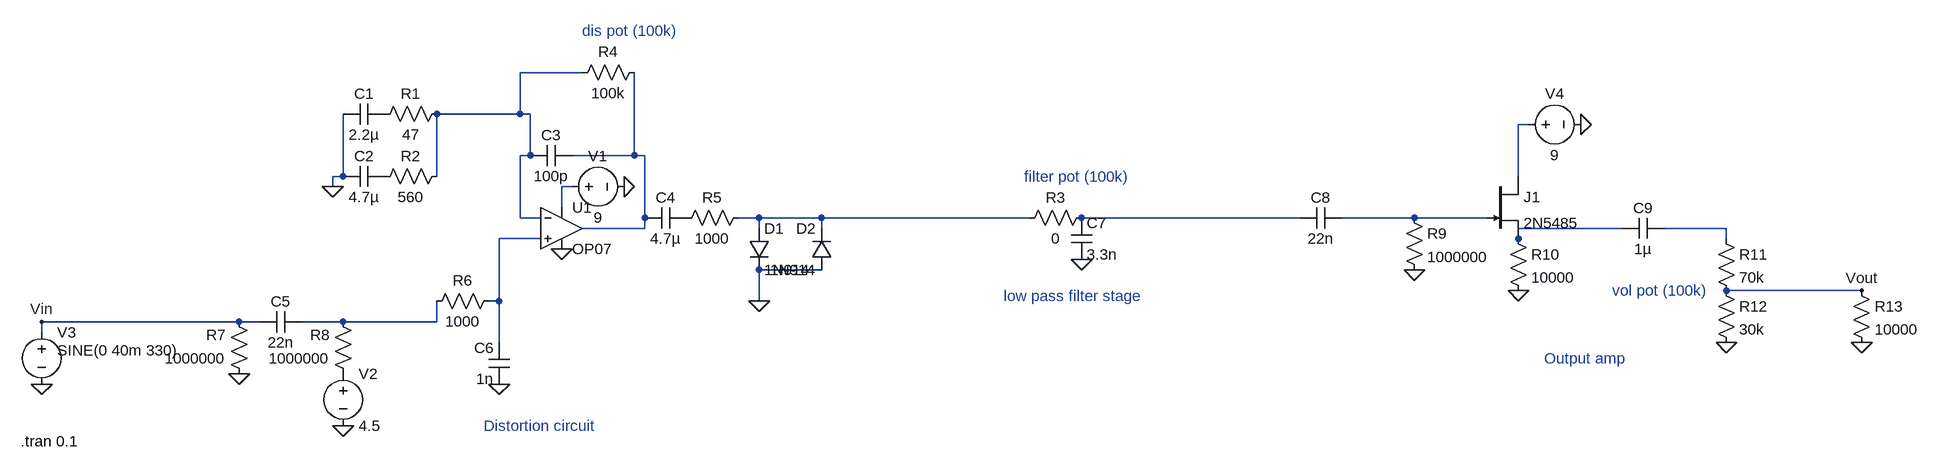
[diagram p0: schematic distortion sim.asc]
distortion sim.asc, the LTspice schematic file:
Version 4
SHEET 1 2480 680
WIRE 416 -864 320 -864
WIRE 320 -800 320 -864
WIRE 320 -800 192 -800
WIRE 336 -800 320 -800
WIRE 1872 -784 1856 -784
WIRE 336 -736 336 -800
WIRE 336 -736 320 -736
WIRE 496 -736 496 -864
WIRE 496 -736 400 -736
WIRE 512 -736 496 -736
WIRE 48 -704 48 -800
WIRE 48 -704 32 -704
WIRE 192 -704 192 -800
WIRE 1856 -704 1856 -784
WIRE 32 -688 32 -704
WIRE 400 -688 384 -688
WIRE 384 -656 384 -688
WIRE 320 -640 320 -736
WIRE 352 -640 320 -640
WIRE 512 -640 512 -736
WIRE 688 -640 656 -640
WIRE 784 -640 688 -640
WIRE 1104 -640 784 -640
WIRE 1520 -640 1184 -640
WIRE 1696 -640 1584 -640
WIRE 1808 -640 1696 -640
WIRE 512 -624 512 -640
WIRE 512 -624 416 -624
WIRE 688 -624 688 -640
WIRE 784 -624 784 -640
WIRE 2016 -624 1856 -624
WIRE 2176 -624 2080 -624
WIRE 352 -608 288 -608
WIRE 1856 -608 1856 -624
WIRE 2176 -608 2176 -624
WIRE 784 -560 688 -560
WIRE 2384 -528 2176 -528
WIRE 288 -512 288 -608
WIRE 288 -512 272 -512
WIRE 688 -512 688 -560
WIRE -112 -480 -416 -480
WIRE -80 -480 -112 -480
WIRE 48 -480 -16 -480
WIRE 192 -480 192 -512
WIRE 192 -480 48 -480
WIRE -416 -464 -416 -480
WIRE 288 -448 288 -512
FLAG 384 -592 0
FLAG 32 -688 0
FLAG 288 -384 0
FLAG -112 -400 0
FLAG 688 -512 0
FLAG 48 -320 0
FLAG -416 -384 0
FLAG 480 -688 0
FLAG 1184 -576 0
FLAG 1952 -784 0
FLAG 1856 -528 0
FLAG 1696 -560 0
FLAG 2176 -448 0
FLAG 2384 -448 0
FLAG -416 -480 Vin
FLAG 2384 -528 Vout
SYMBOL cap 112 -816 R90
WINDOW 0 0 32 VBottom 2
WINDOW 3 32 32 VTop 2
SYMATTR InstName C1
SYMATTR Value 2.2µ
SYMBOL cap 112 -720 R90
WINDOW 0 0 32 VBottom 2
WINDOW 3 32 32 VTop 2
SYMATTR InstName C2
SYMATTR Value 4.7µ
SYMBOL cap 400 -752 R90
WINDOW 0 0 32 VBottom 2
WINDOW 3 32 32 VTop 2
SYMATTR InstName C3
SYMATTR Value 100p
SYMBOL cap 576 -656 R90
WINDOW 0 0 32 VBottom 2
WINDOW 3 32 32 VTop 2
SYMATTR InstName C4
SYMATTR Value 4.7µ
SYMBOL res 208 -816 R90
WINDOW 0 0 56 VBottom 2
WINDOW 3 32 56 VTop 2
SYMATTR InstName R1
SYMATTR Value 47
SYMBOL res 208 -720 R90
WINDOW 0 0 56 VBottom 2
WINDOW 3 32 56 VTop 2
SYMATTR InstName R2
SYMATTR Value 560
SYMBOL res 512 -880 R90
WINDOW 0 0 56 VBottom 2
WINDOW 3 32 56 VTop 2
SYMATTR InstName R4
SYMATTR Value 100k
SYMBOL res 672 -656 R90
WINDOW 0 0 56 VBottom 2
WINDOW 3 32 56 VTop 2
SYMATTR InstName R5
SYMATTR Value 1000
SYMBOL res 288 -528 R90
WINDOW 0 0 56 VBottom 2
WINDOW 3 32 56 VTop 2
SYMATTR InstName R6
SYMATTR Value 1000
SYMBOL res -96 -384 R180
WINDOW 0 36 76 Left 2
WINDOW 3 36 40 Left 2
SYMATTR InstName R7
SYMATTR Value 1000000
SYMBOL res 64 -384 R180
WINDOW 0 36 76 Left 2
WINDOW 3 36 40 Left 2
SYMATTR InstName R8
SYMATTR Value 1000000
SYMBOL cap -16 -496 R90
WINDOW 0 0 32 VBottom 2
WINDOW 3 32 32 VTop 2
SYMATTR InstName C5
SYMATTR Value 22n
SYMBOL cap 304 -384 R180
WINDOW 0 24 56 Left 2
WINDOW 3 24 8 Left 2
SYMATTR InstName C6
SYMATTR Value 1n
SYMBOL Opamps\\OP07 384 -688 R0
SYMATTR InstName U1
SYMBOL diode 672 -624 R0
SYMATTR InstName D1
SYMATTR Value 1N914
SYMBOL diode 800 -560 R180
WINDOW 0 24 64 Left 2
WINDOW 3 24 0 Left 2
SYMATTR InstName D2
SYMATTR Value 1N914
SYMBOL voltage 48 -416 R0
WINDOW 123 0 0 Left 0
WINDOW 39 0 0 Left 0
SYMATTR InstName V2
SYMATTR Value 4.5
SYMBOL voltage -416 -480 R0
WINDOW 3 24 44 Left 2
WINDOW 123 24 44 Left 2
WINDOW 39 0 0 Left 0
SYMATTR Value SINE(0 40m 330)
SYMATTR InstName V3
SYMBOL voltage 384 -688 R270
WINDOW 0 32 56 VTop 2
WINDOW 3 -32 56 VBottom 2
WINDOW 123 0 0 Left 0
WINDOW 39 0 0 Left 0
SYMATTR InstName V1
SYMATTR Value 9
SYMBOL res 1200 -656 R90
WINDOW 0 0 56 VBottom 2
WINDOW 3 32 56 VTop 2
SYMATTR InstName R3
SYMATTR Value 0
SYMBOL cap 1168 -640 R0
SYMATTR InstName C7
SYMATTR Value 3.3n
SYMBOL res 1680 -656 R0
SYMATTR InstName R9
SYMATTR Value 1000000
SYMBOL njf 1808 -704 R0
SYMATTR InstName J1
SYMATTR Value 2N5485
SYMBOL cap 1584 -656 R90
WINDOW 0 0 32 VBottom 2
WINDOW 3 32 32 VTop 2
SYMATTR InstName C8
SYMATTR Value 22n
SYMBOL res 1840 -624 R0
SYMATTR InstName R10
SYMATTR Value 10000
SYMBOL cap 2080 -640 R90
WINDOW 0 0 32 VBottom 2
WINDOW 3 32 32 VTop 2
SYMATTR InstName C9
SYMATTR Value 1µ
SYMBOL res 2160 -624 R0
SYMATTR InstName R11
SYMATTR Value 70k
SYMBOL res 2160 -544 R0
SYMATTR InstName R12
SYMATTR Value 30k
SYMBOL voltage 1856 -784 R270
WINDOW 0 32 56 VTop 2
WINDOW 3 -32 56 VBottom 2
WINDOW 123 0 0 Left 0
WINDOW 39 0 0 Left 0
SYMATTR InstName V4
SYMATTR Value 9
SYMBOL res 2368 -544 R0
SYMATTR InstName R13
SYMATTR Value 10000
TEXT -448 -296 Left 2 !.tran 0.1
TEXT 1064 -520 Left 2 ;low pass filter stage
TEXT 1896 -424 Left 2 ;Output amp
TEXT 264 -320 Left 2 ;Distortion circuit
TEXT 416 -928 Left 2 ;dis pot (100k)
TEXT 1096 -704 Left 2 ;filter pot (100k)
TEXT 2000 -528 Left 2 ;vol pot (100k)

The netlist it stands for:
* distortion sim.asc
C1 P001 0 2.2µ
C2 P002 0 4.7µ
C3 N003 N001 100p
C4 P003 N003 4.7µ
R1 N001 P001 47
R2 N001 P002 560
R4 N003 N001 100k
R5 N005 P003 1000
R6 N010 N011 1000
R7 0 Vin 1000000
R8 P004 N011 1000000
C5 N011 Vin 22n
C6 0 N010 1n
XU1 N010 N001 N004 0 N003 LT1001  ; OP07, pins In+ In- V+ V- OUT
D1 N005 0 1N914
D2 0 N005 1N914
V2 P004 0 4.5
V3 Vin 0 SINE(0 40m 330)
V1 N004 0 9
R3 N006 N005 0
C7 N006 0 3.3n
R9 N007 0 1000000
J1 N002 N007 N008 2N5485
C8 N007 N006 22n
R10 N008 0 10000
C9 N009 N008 1µ
R11 N009 Vout 70k
R12 Vout 0 30k
V4 N002 0 9
R13 Vout 0 10000
.model D D
.lib standard.dio
.model NJF NJF
.model PJF PJF
.lib standard.jft
.tran 0.1
* low pass filter stage
* Output amp
* Distortion circuit
* dis pot (100k)
* filter pot (100k)
* vol pot (100k)
.lib LTC.lib
.backanno
.end